# EAGLE design Adafruit Flora Si1145 (EAGLE 6.3)
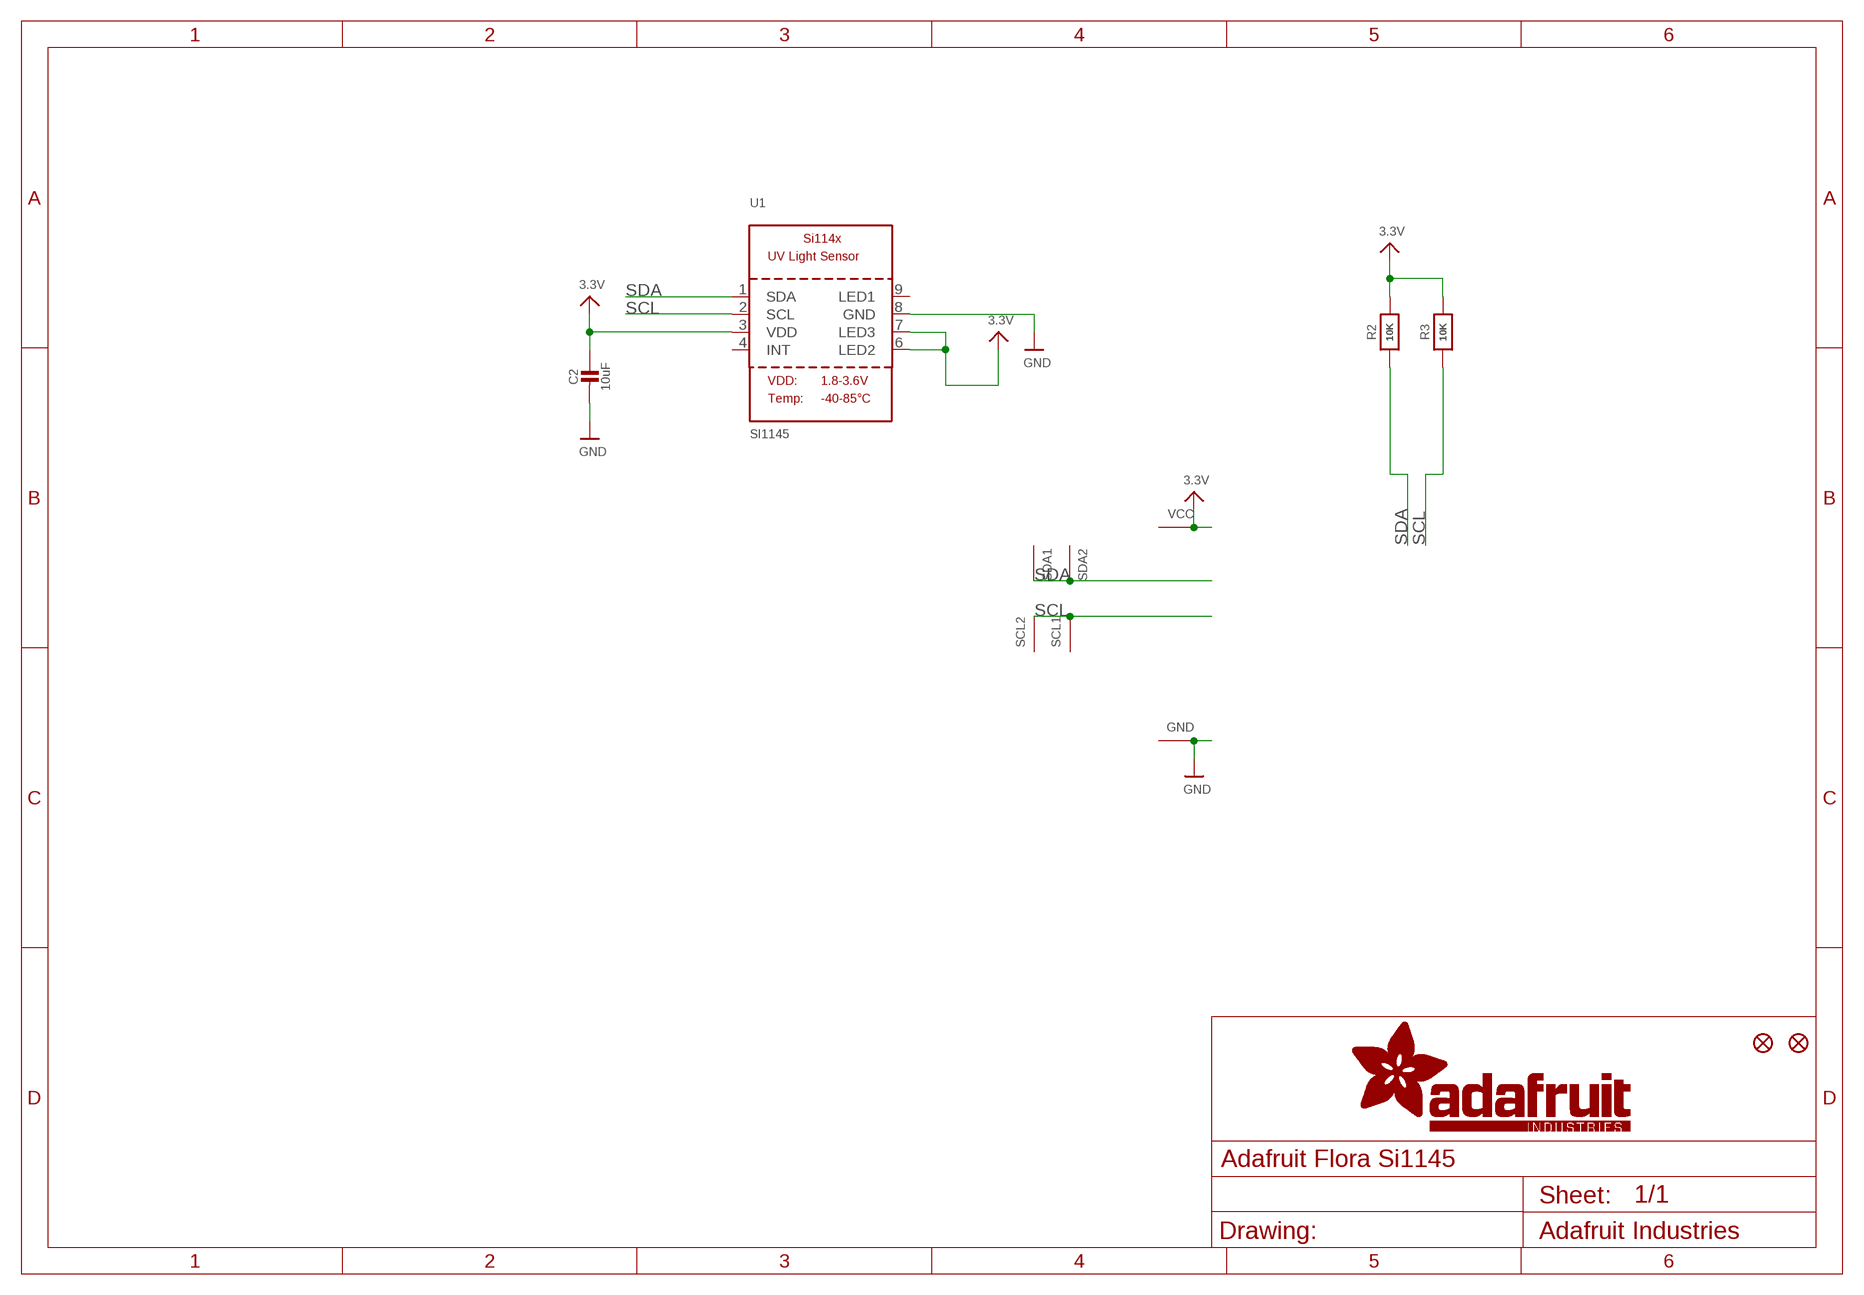
[diagram p0: schematic, sheet 1]

## Parts
C2  10uF  CAP_CERAMIC0805-NOOUTLINE  [0805-NO]
FID1  FIDUCIAL""  [FIDUCIAL_1MM]
FID2  FIDUCIAL""  [FIDUCIAL_1MM]
GND  SEWTAP0.5IN  [SEWINGTAP_0.5]
R2  10K  RESISTOR0805_NOOUTLINE  [0805-NO]
R3  10K  RESISTOR0805_NOOUTLINE  [0805-NO]
SCL1  SEWTAP0.5IN  [SEWINGTAP_0.5]
SCL2  SEWTAP0.5IN  [SEWINGTAP_0.5]
SDA1  SEWTAP0.5IN  [SEWINGTAP_0.5]
SDA2  SEWTAP0.5IN  [SEWINGTAP_0.5]
U1  SI1145  SI114X  [SI114X]
VCC  SEWTAP0.5IN  [SEWINGTAP_0.5]

## Nets
3.3V: C2.1 R2.2 R3.2 U1.3(VDD) U1.6(LED2) U1.7(LED3) VCC.TAP(SEW)
GND: C2.2 GND.TAP(SEW) U1.8(GND)
SCL: R3.1 SCL1.TAP(SEW) SCL2.TAP(SEW) U1.2(SCL)
SDA: R2.1 SDA1.TAP(SEW) SDA2.TAP(SEW) U1.1(SDA)
Unconnected: U1.4(INT) U1.9(LED1)

## Library data of the parts
C2 = microbuilder:CAP_CERAMIC: Ceramic Capacitors For new designs, use the packages preceded by an '_' character since they are more reliable: The following footprints should be used on most boards: _0402 - Standard footprint for regular board layouts _0603 - Standard footprint for regular board layouts _0805 - Standard footprint for regular board layouts _1206 - Standard footprint for regular board layouts For extremely tight-pitch boards where space is at a premium, the following 'micro-pitch' footprints can be used (smaller pads, no silkscreen outline, etc.): _0402MP - Micro-pitch footprint for very dense/compact boards _0603MP - Micro-pitch footprint for very dense/compact boards _0805MP - Micro-pitch footprint for very dense/compact boards _1206MP - Micro-pitch footprint for very dense/compact boards
FID1 FID2 = microbuilder:FIDUCIAL: Fiducial Alignment Points Various fiducial points for machine vision alignment.; BOM: EXCLUDE
GND SCL1 SCL2 SDA1 SDA2 VCC = adafruit:SEWTAP
R2 R3 = microbuilder:RESISTOR: Resistors For new designs, use the packages preceded by an '_' character since they are more reliable: The following footprints should be used on most boards: _0402 - Standard footprint for regular board layouts _0603 - Standard footprint for regular board layouts _0805 - Standard footprint for regular board layouts _1206 - Standard footprint for regular board layouts For extremely tight-pitch boards where space is at a premium, the following 'micro-pitch' footprints can be used (smaller pads, no silkscreen outline, etc.): _0402MP - Micro-pitch footprint for very dense/compact boards _0603MP - Micro-pitch footprint for very dense/compact boards _0805MP - Micro-pitch footprint for very dense/compact boards _1206MP - Micro-pitch footprint for very dense/compact boards
U1 = microbuilder:SI114X: Si1145/1146/1147 Proximity/UV/Ambient Light Sensor 1145 = 1 LED, 1146 = 2 LED, 1147 = 3 LED Proximity: 1-50cm LEDs: 5.6-360mA each

## Board
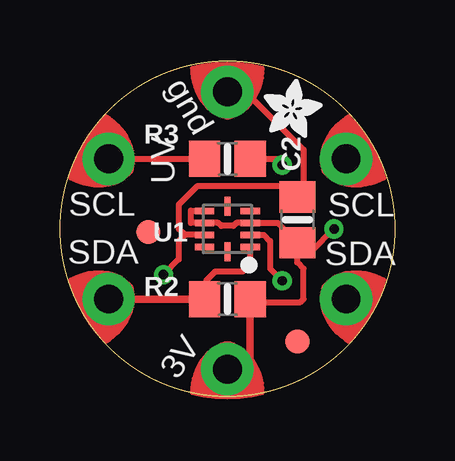
[diagram p1: board, top side]
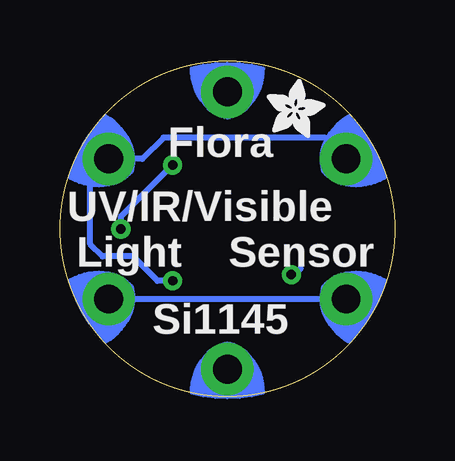
[diagram p2: board, bottom side, seen from below]

Size 13.97 x 13.97 mm. Coordinates in mm from the lower left corner, seen from the top.
Outline: circle at 6.99,6.99 radius 6.99
Copper layers (1*16): Top 0.035mm / dielectric 1.5mm / Bottom 0.035mm
Design rules "adafruit": minimum track width 8mil, minimum drill 15.5mil, track to track 8mil, track to pad 8mil, pad to pad 8mil, via to via 8mil, smd to smd 8mil, copper to edge 10mil, drill to drill 8mil, minimum pad ring 10mil, minimum via ring 8mil, stop-mask expansion 2mil, vias tented up to drill 20mil, thermal gap 10mil

### Footprints (pad centres in the part's own frame; a part is rotated, then mirrored left to right if it is on the bottom)
0805-NO = smd 1.3 x 1.5: 1 -0.95,0; 2 0.95,0
FIDUCIAL_1MM = smd 1 x 1: 1 0,0
SEWINGTAP_0.5 = drill 1.2 pad 2.184: TAP 0,0
SI114X = smd 0.8 x 0.26: 1 -0.95,0.75; 2 -0.95,0.25; 3 -0.95,-0.25; 4 -0.95,-0.75; 6 0.95,-0.75; 7 0.95,-0.25; 8 0.95,0.25; 9 0.95,0.75 | smd 0.26 x 0.8: 5 0,-0.95; 10 0,0.95

### Placement (x,y rotation side)
C2  9.91,7.37 90 top
FID1  3.68,6.86 0 top
FID2  9.91,2.29 0 top
GND  6.99,12.7 0 top
R2  6.99,4.06 0 top
R3  6.99,9.91 0 top
SCL1  11.94,9.91 300 top
SCL2  2.03,9.91 60 top
SDA1  11.94,4.06 240 top
SDA2  2.03,4.06 120 top
U1  6.99,6.99 180 top
U$3  [ADAFRUIT_2.5MM]  5.33,10.79 0 bottom
U$4  [ADAFRUIT_2.5MM]  8.51,10.79 0 top
VCC  6.99,1.14 180 top

### Tracks (layer width: path | path; a pad name or v marks a point on that pad's centre or on a via)
3.3V  (via drill 0.39)
  Top 0.254: C2.1 9.09,7.24 U1.3 7.36,7.24 7.24,7.11 6.73,7.11 6.6,7.24 U1.7 5.46,7.24 5.46,7.75 6.02,7.75 U1.6 | R3.2 9.02,9.91 v9.27,9.65 | v11.43,6.99 10.48,6.04 C2.1 | 7.94,4.19 8.19,3.94 10.03,3.94 10.16,4.06 10.16,5.33 9.91,5.59 C2.1
  Top 0.305: VCC.TAP 7.94,1.14 R2.2 7.94,4.19
  Bottom 0.254: v9.27,9.65 11.43,7.49 v11.43,6.99
GND  (via drill 0.39)
  Top 0.254: GND.TAP 7.75,12.7 10.16,10.29 10.16,8.57 C2.2 9.46,8.76 5.71,8.76 4.95,8 4.95,6.99 5.21,6.74 | U1.8 5.21,6.74 | 5.21,6.74 4.95,6.48 4.95,5.71 v4.32,5.08
  Bottom 0.254: v4.32,5.08 4.19,5.08 3.94,5.33
SCL  (via drill 0.39)
  Top 0.254: SCL2.TAP R3.1 | U1.2 8.51,6.74 8.76,6.48 8.76,5.33 v9.27,4.83
  Bottom 0.254: SCL2.TAP 2.92,10.79 9.65,10.79 10.54,9.91 SCL1.TAP 12.7,9.14 12.7,6.35 12.19,5.84 10.92,5.84 9.91,4.83 v9.27,4.83
SDA
  Top 0.254: U1.1 7.94,5.52 7.62,5.21 6.48,5.21 6.1,4.83 6.1,4.12 R2.1
  Top 0.305: SDA2.TAP R2.1
  Bottom 0.254: SDA2.TAP SDA1.TAP

### Text on the board
tPlace: gnd | UV | SCL | SCL | SDA | SDA | 3V
bPlace: Flora | UV/IR/Visible | Sensor | Light | Si1145